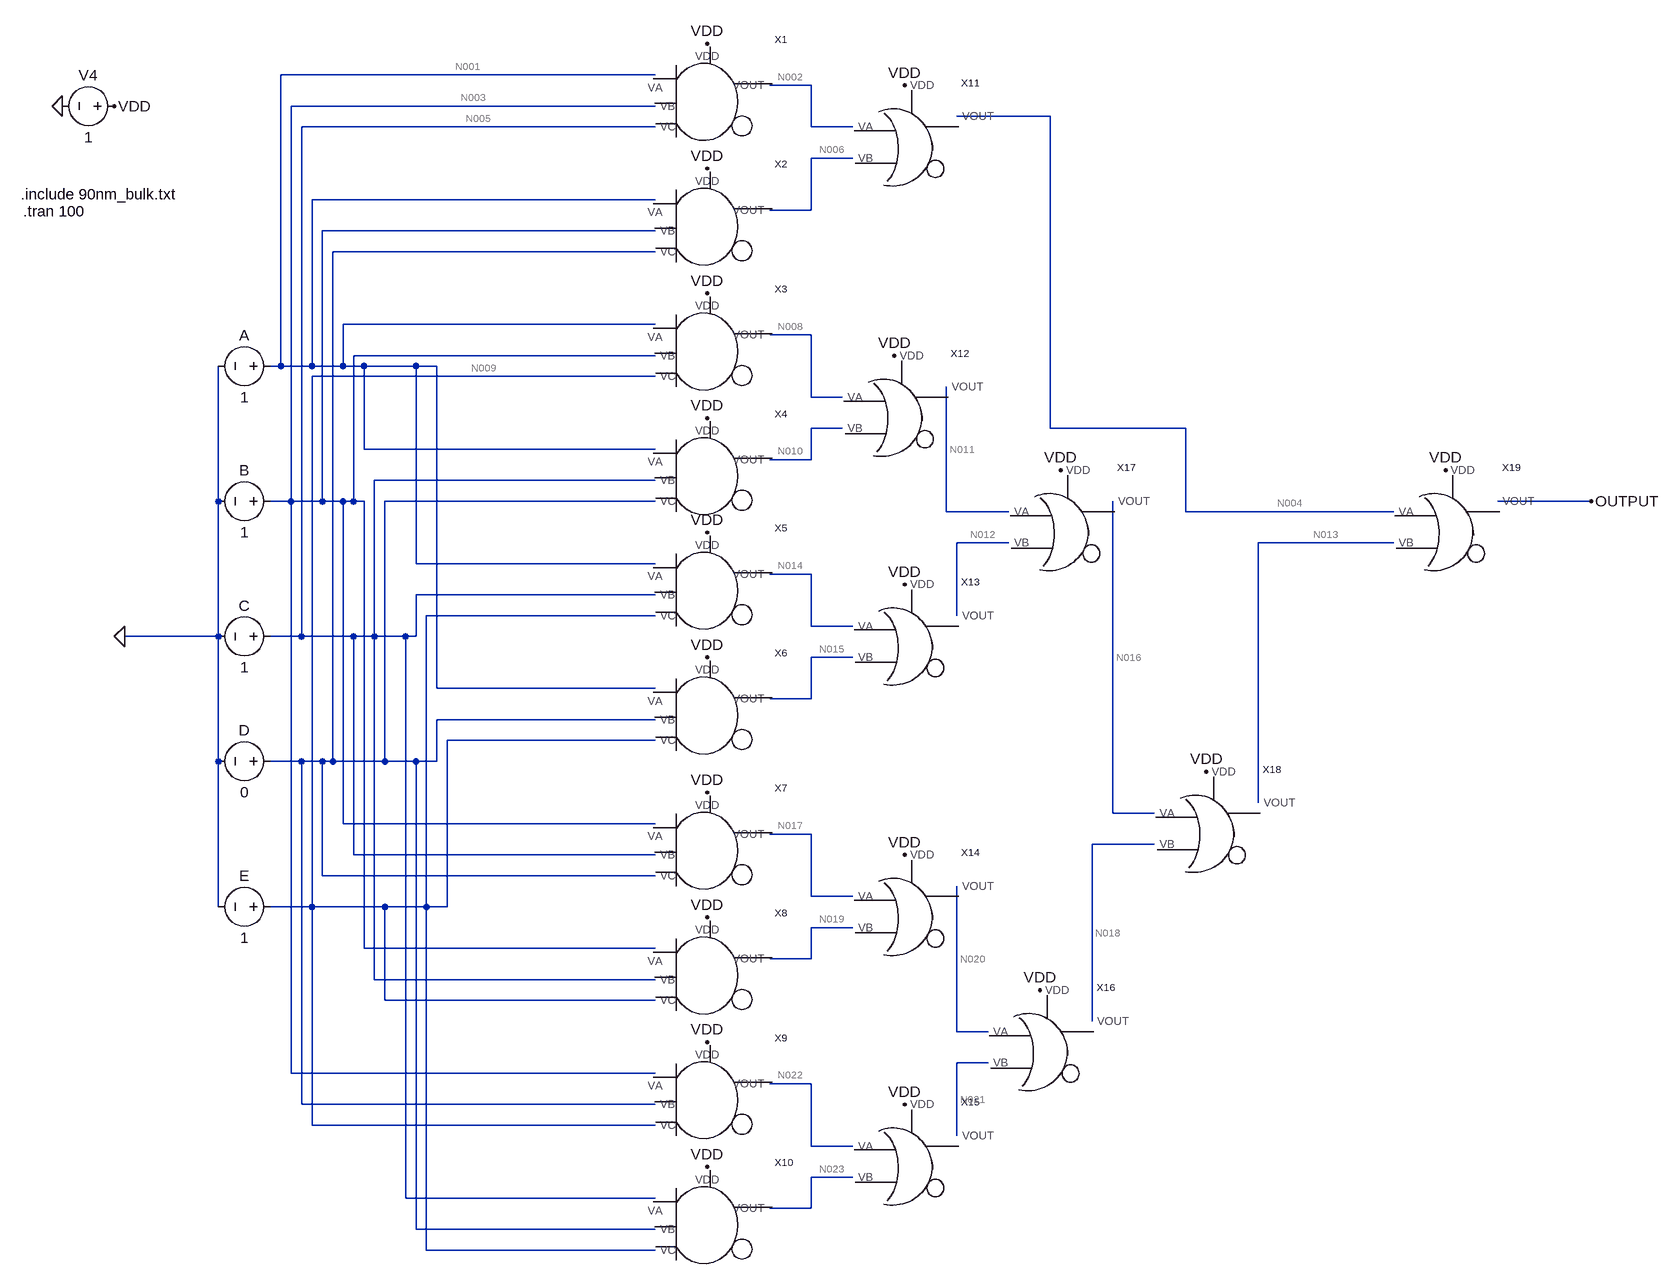
[diagram p0: schematic VeryFinal.asc]
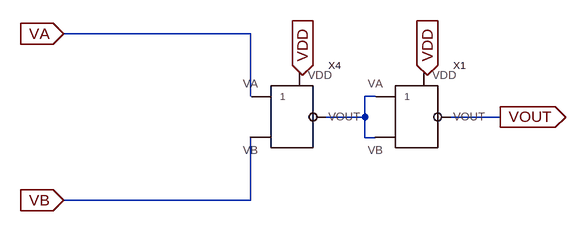
[diagram p1: sub-circuit aorb.asc]
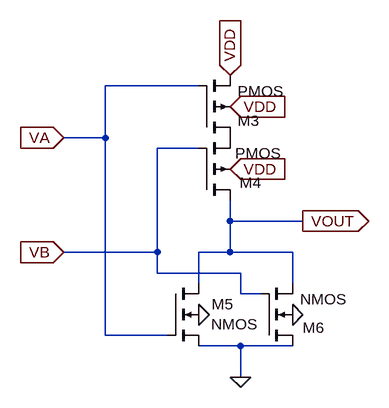
[diagram p2: sub-circuit nor.asc]
VeryFinal.asc, the LTspice schematic file:
Version 4
SHEET 1 2208 1444
WIRE 656 -384 80 -384
WIRE 896 -368 832 -368
WIRE 656 -336 96 -336
WIRE 1264 -320 1120 -320
WIRE 656 -304 112 -304
WIRE 896 -304 896 -368
WIRE 960 -304 896 -304
WIRE 960 -256 896 -256
WIRE 656 -192 128 -192
WIRE 896 -176 896 -256
WIRE 896 -176 832 -176
WIRE 656 -144 144 -144
WIRE 656 -112 160 -112
WIRE 656 0 176 0
WIRE 896 16 832 16
WIRE 656 48 192 48
WIRE 80 64 80 -384
WIRE 80 64 64 64
WIRE 128 64 128 -192
WIRE 128 64 80 64
WIRE 176 64 176 0
WIRE 176 64 128 64
WIRE 208 64 176 64
WIRE 288 64 208 64
WIRE 320 64 288 64
WIRE 656 80 128 80
WIRE 896 112 896 16
WIRE 944 112 896 112
WIRE 944 160 896 160
WIRE 1264 160 1264 -320
WIRE 1472 160 1264 160
WIRE 208 192 208 64
WIRE 656 192 208 192
WIRE 896 208 896 160
WIRE 896 208 832 208
WIRE 656 240 224 240
WIRE -16 272 -16 64
WIRE 96 272 96 -336
WIRE 96 272 64 272
WIRE 144 272 144 -144
WIRE 144 272 96 272
WIRE 176 272 144 272
WIRE 192 272 192 48
WIRE 192 272 176 272
WIRE 208 272 192 272
WIRE 656 272 240 272
WIRE 2096 272 1952 272
WIRE 1104 288 1104 96
WIRE 1200 288 1104 288
WIRE 1472 288 1472 160
WIRE 1792 288 1472 288
WIRE 1200 336 1120 336
WIRE 1792 336 1584 336
WIRE 288 368 288 64
WIRE 656 368 288 368
WIRE 896 384 832 384
WIRE 656 416 288 416
WIRE 656 448 304 448
WIRE 1120 448 1120 336
WIRE 896 464 896 384
WIRE 960 464 896 464
WIRE -16 480 -16 272
WIRE -16 480 -160 480
WIRE 112 480 112 -304
WIRE 112 480 64 480
WIRE 192 480 112 480
WIRE 224 480 224 240
WIRE 224 480 192 480
WIRE 272 480 224 480
WIRE 288 480 288 416
WIRE 288 480 272 480
WIRE 960 512 896 512
WIRE 320 560 320 64
WIRE 656 560 320 560
WIRE 896 576 896 512
WIRE 896 576 832 576
WIRE 656 608 320 608
WIRE 656 640 336 640
WIRE -16 672 -16 480
WIRE 112 672 64 672
WIRE 144 672 112 672
WIRE 160 672 160 -112
WIRE 160 672 144 672
WIRE 240 672 240 272
WIRE 240 672 160 672
WIRE 288 672 240 672
WIRE 320 672 320 608
WIRE 320 672 288 672
WIRE 1584 736 1584 336
WIRE 1360 752 1360 272
WIRE 1424 752 1360 752
WIRE 176 768 176 272
WIRE 656 768 176 768
WIRE 896 784 832 784
WIRE 1424 800 1328 800
WIRE 192 816 192 480
WIRE 656 816 192 816
WIRE 144 848 144 672
WIRE 656 848 144 848
WIRE 896 880 896 784
WIRE 960 880 896 880
WIRE -16 896 -16 672
WIRE 128 896 128 80
WIRE 128 896 64 896
WIRE 240 896 128 896
WIRE 304 896 304 448
WIRE 304 896 240 896
WIRE 336 896 336 640
WIRE 336 896 304 896
WIRE 960 928 896 928
WIRE 208 960 208 272
WIRE 656 960 208 960
WIRE 896 976 896 928
WIRE 896 976 832 976
WIRE 224 1008 224 480
WIRE 656 1008 224 1008
WIRE 240 1040 240 896
WIRE 656 1040 240 1040
WIRE 1328 1072 1328 800
WIRE 1120 1088 1120 864
WIRE 1168 1088 1120 1088
WIRE 1168 1136 1120 1136
WIRE 96 1152 96 272
WIRE 656 1152 96 1152
WIRE 896 1168 832 1168
WIRE 112 1200 112 672
WIRE 656 1200 112 1200
WIRE 128 1232 128 896
WIRE 656 1232 128 1232
WIRE 1120 1248 1120 1136
WIRE 896 1264 896 1168
WIRE 960 1264 896 1264
WIRE 960 1312 896 1312
WIRE 272 1344 272 480
WIRE 656 1344 272 1344
WIRE 896 1360 896 1312
WIRE 896 1360 832 1360
WIRE 288 1392 288 672
WIRE 656 1392 288 1392
WIRE 304 1424 304 896
WIRE 656 1424 304 1424
FLAG -256 -336 0
FLAG -176 -336 VDD
FLAG -160 480 0
FLAG 736 -432 VDD
FLAG 736 -240 VDD
FLAG 736 -48 VDD
FLAG 736 144 VDD
FLAG 736 320 VDD
FLAG 736 512 VDD
FLAG 736 720 VDD
FLAG 736 912 VDD
FLAG 736 1104 VDD
FLAG 736 1296 VDD
FLAG 1040 -368 VDD
FLAG 1024 48 VDD
FLAG 1280 224 VDD
FLAG 1040 400 VDD
FLAG 1040 816 VDD
FLAG 1248 1024 VDD
FLAG 1040 1200 VDD
FLAG 1504 688 VDD
FLAG 1872 224 VDD
FLAG 2096 272 OUTPUT
SYMBOL voltage 80 64 R90
WINDOW 0 -32 56 VBottom 2
WINDOW 3 32 56 VTop 2
WINDOW 123 0 0 Left 0
WINDOW 39 0 0 Left 0
SYMATTR InstName A
SYMATTR Value 1
SYMBOL voltage 80 272 R90
WINDOW 0 -32 56 VBottom 2
WINDOW 3 32 56 VTop 2
WINDOW 123 0 0 Left 0
WINDOW 39 0 0 Left 0
SYMATTR InstName B
SYMATTR Value 1
SYMBOL voltage 80 480 R90
WINDOW 0 -32 56 VBottom 2
WINDOW 3 32 56 VTop 2
WINDOW 123 0 0 Left 0
WINDOW 39 0 0 Left 0
SYMATTR InstName C
SYMATTR Value 1
SYMBOL voltage -160 -336 R90
WINDOW 0 -32 56 VBottom 2
WINDOW 3 32 56 VTop 2
WINDOW 123 0 0 Left 0
WINDOW 39 0 0 Left 0
SYMATTR InstName V4
SYMATTR Value 1
SYMBOL voltage 80 672 R90
WINDOW 0 -32 56 VBottom 2
WINDOW 3 32 56 VTop 2
WINDOW 123 0 0 Left 0
WINDOW 39 0 0 Left 0
SYMATTR InstName D
SYMATTR Value 0
SYMBOL voltage 80 896 R90
WINDOW 0 -32 56 VBottom 2
WINDOW 3 32 56 VTop 2
WINDOW 123 0 0 Left 0
WINDOW 39 0 0 Left 0
SYMATTR InstName E
SYMATTR Value 1
SYMBOL aandbandc 720 -336 R0
SYMATTR InstName X1
SYMBOL aandbandc 720 -144 R0
SYMATTR InstName X2
SYMBOL aandbandc 720 48 R0
SYMATTR InstName X3
SYMBOL aandbandc 720 240 R0
SYMATTR InstName X4
SYMBOL aandbandc 720 416 R0
SYMATTR InstName X5
SYMBOL aandbandc 720 608 R0
SYMATTR InstName X6
SYMBOL aandbandc 720 816 R0
SYMATTR InstName X7
SYMBOL aandbandc 720 1008 R0
SYMATTR InstName X8
SYMBOL aandbandc 720 1200 R0
SYMATTR InstName X9
SYMBOL aandbandc 720 1392 R0
SYMATTR InstName X10
SYMBOL aorb 992 -272 R0
SYMATTR InstName X11
SYMBOL aorb 976 144 R0
SYMATTR InstName X12
SYMBOL aorb 992 496 R0
SYMATTR InstName X13
SYMBOL aorb 992 912 R0
SYMATTR InstName X14
SYMBOL aorb 992 1296 R0
SYMATTR InstName X15
SYMBOL aorb 1200 1120 R0
SYMATTR InstName X16
SYMBOL aorb 1232 320 R0
SYMATTR InstName X17
SYMBOL aorb 1456 784 R0
SYMATTR InstName X18
SYMBOL aorb 1824 320 R0
SYMATTR InstName X19
TEXT -316 -174 Left 2 !.tran 100
TEXT -320 -200 Left 2 !.include 90nm_bulk.txt

aorb.asc, the sub-circuit schematic file:
Version 4
SHEET 1 1372 1632
WIRE 400 576 112 576
WIRE 400 672 400 576
WIRE 592 672 576 672
WIRE 576 704 576 672
WIRE 576 704 512 704
WIRE 784 704 704 704
WIRE 576 736 576 704
WIRE 592 736 576 736
WIRE 400 832 400 736
WIRE 400 832 112 832
FLAG 112 576 VA
IOPIN 112 576 In
FLAG 112 832 VB
IOPIN 112 832 In
FLAG 480 640 VDD
IOPIN 480 640 In
FLAG 784 704 VOUT
IOPIN 784 704 Out
FLAG 672 640 VDD
IOPIN 672 640 In
SYMBOL nor 464 704 R0
SYMATTR InstName X4
SYMBOL nor 656 704 R0
SYMATTR InstName X1

nor.asc, the sub-circuit schematic file:
Version 4
SHEET 1 880 680
WIRE -656 -16 -800 -16
WIRE -800 64 -800 -16
WIRE -800 64 -864 64
WIRE -656 80 -720 80
WIRE -608 192 -608 160
WIRE -496 192 -608 192
WIRE -720 240 -720 80
WIRE -720 240 -864 240
WIRE -608 240 -608 192
WIRE -608 240 -656 240
WIRE -512 240 -608 240
WIRE -720 272 -720 240
WIRE -592 272 -720 272
WIRE -656 288 -656 240
WIRE -512 288 -512 240
WIRE -592 304 -592 272
WIRE -560 304 -592 304
WIRE -800 368 -800 64
WIRE -704 368 -800 368
WIRE -592 384 -656 384
WIRE -512 384 -592 384
WIRE -592 432 -592 384
FLAG -592 432 0
FLAG -608 -32 VDD
IOPIN -608 -32 In
FLAG -656 336 0
FLAG -512 336 0
FLAG -864 64 VA
IOPIN -864 64 In
FLAG -864 240 VB
IOPIN -864 240 In
FLAG -496 192 VOUT
IOPIN -496 192 Out
FLAG -608 16 VDD
IOPIN -608 16 In
FLAG -608 112 VDD
IOPIN -608 112 In
SYMBOL pmos4 -656 64 M180
WINDOW 0 60 26 Left 2
WINDOW 3 60 72 Left 2
SYMATTR InstName M3
SYMBOL pmos4 -656 160 M180
WINDOW 0 63 27 Left 2
SYMATTR InstName M4
SYMBOL nmos4 -704 288 R0
WINDOW 0 68 32 Left 2
WINDOW 3 67 63 Left 2
SYMATTR InstName M5
SYMBOL nmos4 -560 384 M180
WINDOW 0 64 28 Left 2
WINDOW 3 60 72 Left 2
SYMATTR InstName M6

The netlist it stands for:
* VeryFinal.asc
V§A N001 0 1
V§B N003 0 1
V§C N005 0 1
V4 VDD 0 1
V§D N007 0 0
V§E N009 0 1
XX1 N001 N003 N005 VDD N002 aandbandc  ; pins VA VB VC VDD VOUT
XX2 N001 N003 N007 VDD N006 aandbandc  ; pins VA VB VC VDD VOUT
XX3 N001 N003 N009 VDD N008 aandbandc  ; pins VA VB VC VDD VOUT
XX4 N001 N005 N007 VDD N010 aandbandc  ; pins VA VB VC VDD VOUT
XX5 N001 N005 N009 VDD N014 aandbandc  ; pins VA VB VC VDD VOUT
XX6 N001 N007 N009 VDD N015 aandbandc  ; pins VA VB VC VDD VOUT
XX7 N003 N005 N007 VDD N017 aandbandc  ; pins VA VB VC VDD VOUT
XX8 N003 N005 N009 VDD N019 aandbandc  ; pins VA VB VC VDD VOUT
XX9 N003 N007 N009 VDD N022 aandbandc  ; pins VA VB VC VDD VOUT
XX10 N005 N007 N009 VDD N023 aandbandc  ; pins VA VB VC VDD VOUT
XX11 N002 N006 VDD N004 aorb
XX12 N008 N010 VDD N011 aorb
XX13 N014 N015 VDD N012 aorb
XX14 N017 N019 VDD N020 aorb
XX15 N022 N023 VDD N021 aorb
XX16 N020 N021 VDD N018 aorb
XX17 N011 N012 VDD N016 aorb
XX18 N016 N018 VDD N013 aorb
XX19 N004 N013 VDD OUTPUT aorb

* block symbol definitions
.subckt aorb VA VB VDD VOUT
XX4 VA VB VDD N001 nor
XX1 N001 N001 VDD VOUT nor
.ends aorb

.subckt nor VA VB VDD VOUT
M3 P001 VA VDD VDD PMOS
M4 VOUT VB P001 VDD PMOS
M5 VOUT VA 0 0 NMOS
M6 0 VB VOUT 0 NMOS
.ends nor

.model NMOS NMOS
.model PMOS PMOS
.lib standard.mos
.tran 100
.include 90nm_bulk.txt
.backanno
.end

* Results of the author's LTspice run, read from the files saved beside the schematic
* Operating Point, zero values left out:
*   V(n001) = 1 V
*   V(n003) = 1 V
*   V(n005) = 1 V
*   V(vdd) = 1 V
*   V(n009) = 1 V
*   V(n002) = 957.5 mV
*   V(n006) = 1.257 mV
*   V(n008) = 957.5 mV
*   V(n010) = 1.257 mV
*   V(n014) = 957.5 mV
*   V(n015) = 1.256 mV
*   V(n017) = 1.257 mV
*   V(n019) = 957.5 mV
*   V(n022) = 1.263 mV
*   V(n023) = 1.263 mV
*   V(n004) = 957.5 mV
*   V(n011) = 957.5 mV
*   V(n012) = 957.5 mV
*   V(n020) = 957.5 mV
*   V(n021) = 1.072 mV
*   V(n018) = 957.5 mV
*   V(n016) = 957.5 mV
*   V(n013) = 957.5 mV
*   V(output) = 999.7 mV
*   I(E) = -13.18 µA
*   I(D) = 31.75 nA
*   I(V4) = -27.5 µA
*   I(C) = -13.18 µA
*   I(B) = -13.18 µA
*   I(A) = -13.18 µA